# Altium schematic sheet 17 USB Type C.SchDoc
size 420 x 297 mm
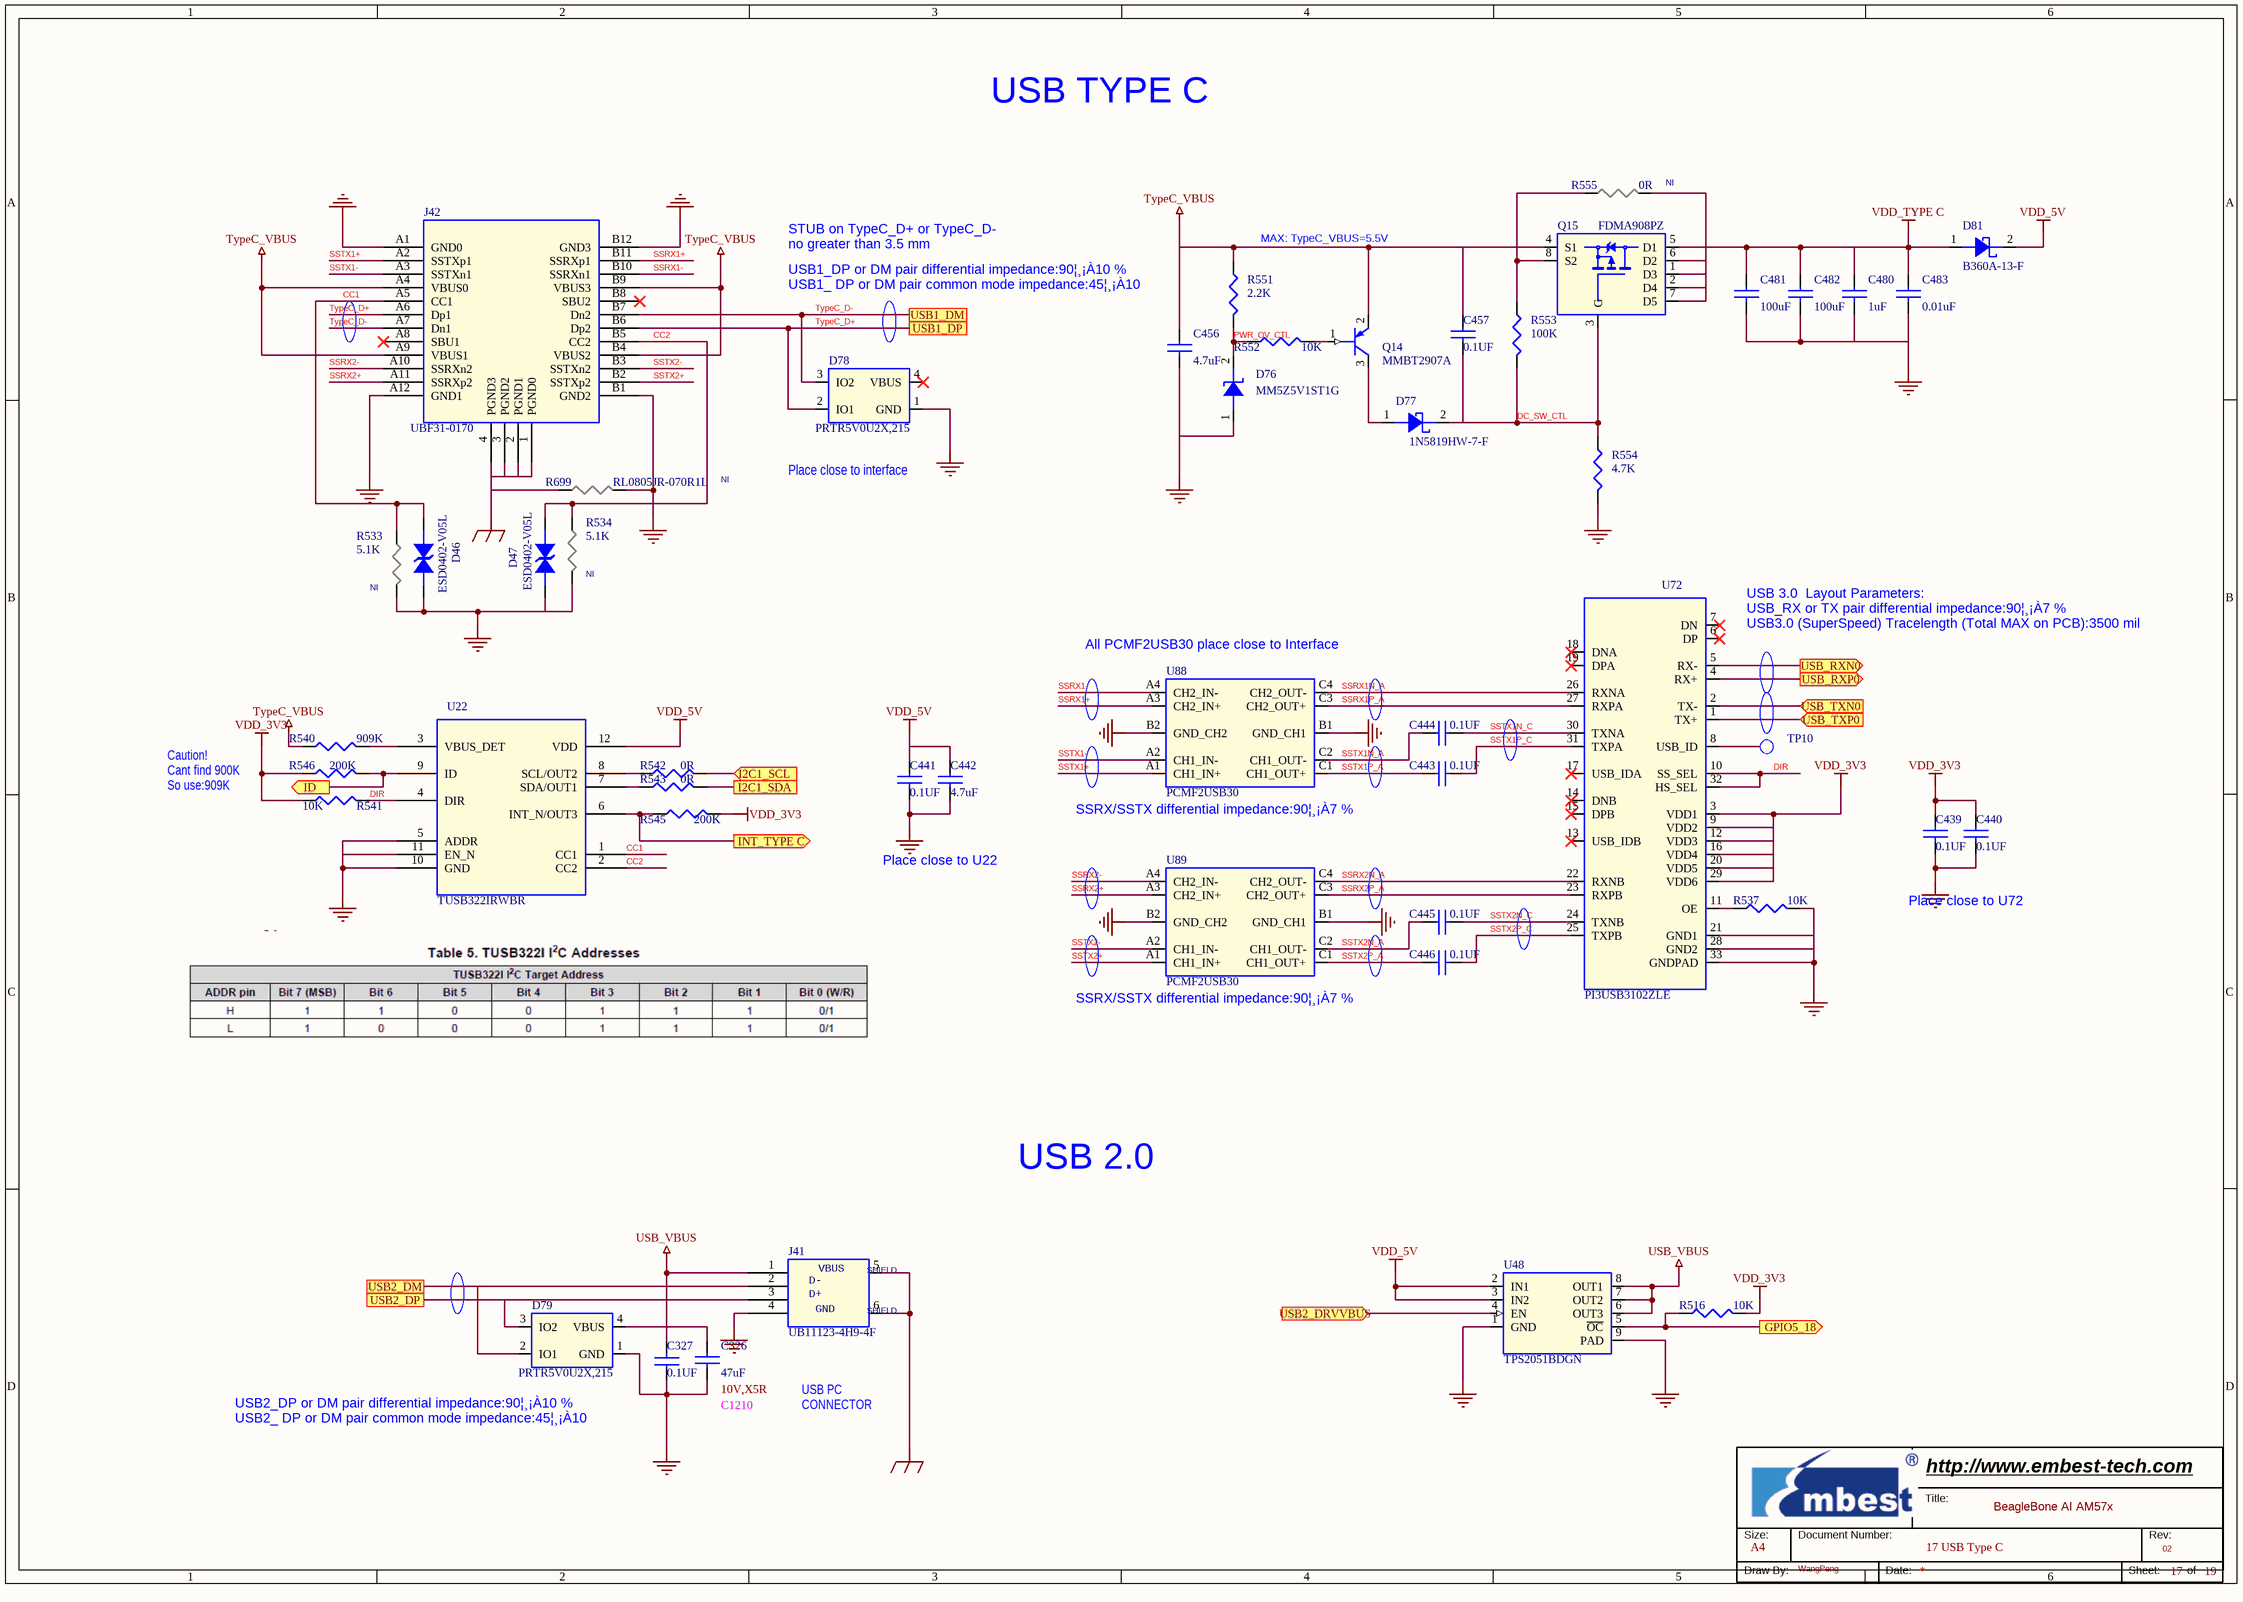
[diagram p0: 17 USB Type C.SchDoc]

## Parts
*  Page Count: 19  Page Number: 17  Page Size: A4  Title: BeagleBone AI AM57x  RevCode: 02  Doc: 17 USB Type C  Drawing: WangPeng  (hidden comment: Embest Title)  (graphical)
C326  47uF  Rating: 10V,X5R  [C1210]
C327  0.1UF  [C0402]
C439  0.1UF  [C0402]
C440  0.1UF  [C0402]
C441  0.1UF  [C0402]
C442  4.7uF  [C0603]
C443  0.1UF  [C0402]
C444  0.1UF  [C0402]
C445  0.1UF  [C0402]
C446  0.1UF  [C0402]
C456  4.7uF  [C0603]
C457  0.1UF  [C0402]
C480  1uF  [C0402]
C481  100uF  [C1210]
C482  100uF  [C1210]
C483  0.01uF  [C0402]
D46  ESD0402-V05L  [D0402]
D47  ESD0402-V05L  [D0402]
D76  MM5Z5V1ST1G  [sod523]
D77  1N5819HW-7-F  [sod123_a]
D78  PRTR5V0U2X,215  [SOT143_190P240X115-4N]
D79  PRTR5V0U2X,215  [SOT143_190P240X115-4N]
D81  B360A-13-F  [D_SMA]
J41  UB11123-4H9-4F  [usb_a_sh]
J42  UBF31-0170  [USB_MTCONN_UBF31-0170]
Q14  MMBT2907A  [SOT23_123]
Q15  FDMA908PZ  [DFN6_2FN]
R516  10K  [R0402]
R533  5.1K  ASSY: NI  [R0402]
R534  5.1K  ASSY: NI  [R0402]
R537  10K  [R0402]
R540  909K  [R0402]
R541  10K  [R0402]
R542  0R  [R0402]
R543  0R  [R0402]
R545  200K  [R0402]
R546  200K  [R0402]
R551  2.2K  [R0402]
R552  10K  [R0402]
R553  100K  [R0402]
R554  4.7K  [R0402]
R555  0R  ASSY: NI  [R0805]
R699  RL0805JR-070R1L  ASSY: NI  [R0805]
TP10  NI  [TP1-8040]  (value not drawn)
U22  TUSB322IRWBR  [X2QFN40P160X160X40-12N]
U48  TPS2051BDGN  [SOP8_1FH]
U72  PI3USB3102ZLE  [QFN40P300x600x80-33N]
U88  PCMF2USB30  [WLCSP10C40p3x4_117x157x60N]
U89  PCMF2USB30  [WLCSP10C40p3x4_117x157x60N]

## Ports
GPIO5_18 (out), I2C1_SCL (in), I2C1_SDA, ID (out), INT_TYPE C (out), USB1_DM, USB1_DP, USB2_DM, USB2_DP, USB2_DRVVBUS (in), USB_RXN0 (out), USB_RXP0 (out), USB_TXN0 (in), USB_TXP0 (in)

## Nets
GND: C326.2 C327.1 C439.2 C440.2 C441.2 C442.2 C456.2 C480.2 C481.2 C482.2 C483.2 D46.1 D47.1 D76.1(A) D78.1(GND) D79.1(GND) J41.4(P4) J42.A1(GND0) J42.A12(GND1) J42.B1(GND2) J42.B12(GND3) R533.2 R534.2 R537.2 R554.2 R699.2 U22.5(ADDR) U22.10(GND) U22.11(EN_N) U48.1(GND) U48.9(PAD) U72.21(GND1) U72.28(GND2) U72.33(GNDPAD) U88.B1(GND_CH1) U88.B2(GND_CH2) U89.B1(GND_CH1) U89.B2(GND_CH2)
GND_EARTH: J41.5(SHELD1) J41.6(PAD4) J42.1(PGND0) J42.2(PGND1) J42.3(PGND2) J42.4(PGND3) R699.1
TypeC_VBUS: C456.1 C457.1 J42.A4(VBUS0) J42.A9(VBUS1) J42.B4(VBUS2) J42.B9(VBUS3) Q14.2(E) Q15.4(S1) R540.1 R551.1
USB_VBUS: C327.2 J41.1(P1) U48.6(OUT3) U48.7(OUT2) U48.8(OUT1)
VDD_3V3: C439.1 C440.1 R516.2 R541.2 R545.2 R546.1 U72.3(VDD1) U72.9(VDD2) U72.12(VDD3) U72.16(VDD4) U72.20(VDD5) U72.29(VDD6)
VDD_5V: C441.1 C442.1 D81.2(C) U22.12(VDD) U48.2(IN1) U48.3(IN2)
VDD_TYPE C: C480.1 C481.1 C482.1 C483.1 D81.1(A) Q15.5(D1)
CC1: D46.2 J42.A5(CC1) R533.1 U22.1(CC1)
CC2: D47.2 J42.B5(CC2) R534.1 U22.2(CC2)
DC_SW_CTL: C457.2 D77.2(C) Q15.3(G) R553.2 R554.1
DIR: R541.1 U22.4(DIR) U72.10(SS_SEL) U72.32(HS_SEL)
GPIO5_18: R516.1 U48.5(~{OC}) ; port GPIO5_18
I2C1_SCL: R542.2 ; port I2C1_SCL
I2C1_SDA: R543.2 ; port I2C1_SDA
ID: R546.2 U22.9(ID) ; port ID
INT_TYPE C: R545.1 U22.6(INT_N/OUT3) ; port INT_TYPE C
PWR_OV_CTL: D76.2(C) R551.2 R552.1
SSRX1+: J42.B11(SSRXp1) U88.A3(CH2_IN+)
SSRX1-: J42.B10(SSRXn1) U88.A4(CH2_IN-)
SSRX1N_A: U72.26(RXNA) U88.C4(CH2_OUT-)
SSRX1P_A: U72.27(RXPA) U88.C3(CH2_OUT+)
SSRX2+: J42.A11(SSRXp2) U89.A3(CH2_IN+)
SSRX2-: J42.A10(SSRXn2) U89.A4(CH2_IN-)
SSRX2N_A: U72.22(RXNB) U89.C4(CH2_OUT-)
SSRX2P_A: U72.23(RXPB) U89.C3(CH2_OUT+)
SSTX1+: J42.A2(SSTXp1) U88.A1(CH1_IN+)
SSTX1-: J42.A3(SSTXn1) U88.A2(CH1_IN-)
SSTX1N_A: C444.1 U88.C2(CH1_OUT-)
SSTX1N_C: C444.2 U72.30(TXNA)
SSTX1P_A: C443.1 U88.C1(CH1_OUT+)
SSTX1P_C: C443.2 U72.31(TXPA)
SSTX2+: J42.B2(SSTXp2) U89.A1(CH1_IN+)
SSTX2-: J42.B3(SSTXn2) U89.A2(CH1_IN-)
SSTX2N_A: C445.1 U89.C2(CH1_OUT-)
SSTX2N_C: C445.2 U72.24(TXNB)
SSTX2P_A: C446.1 U89.C1(CH1_OUT+)
SSTX2P_C: C446.2 U72.25(TXPB)
TypeC_D+: D78.2(IO1) J42.A6(Dp1) J42.B6(Dp2) ; port USB1_DP
TypeC_D-: D78.3(IO2) J42.A7(Dn1) J42.B7(Dn2) ; port USB1_DM
USB2_DM: D79.2(IO1) J41.2(P2) ; port USB2_DM
USB2_DP: D79.3(IO2) J41.3(P3) ; port USB2_DP
USB2_DRVVBUS: U48.4(EN) ; port USB2_DRVVBUS
USB_RXN0: U72.5(RX-) ; port USB_RXN0
USB_RXP0: U72.4(RX+) ; port USB_RXP0
USB_TXN0: U72.2(TX-) ; port USB_TXN0
USB_TXP0: U72.1(TX+) ; port USB_TXP0
NetC326_1: C326.1 D79.4(VBUS)
NetD77_1: D77.1(A) Q14.3(C)
NetQ14_1: Q14.1(B) R552.2
NetQ15_1: Q15.1(D3) Q15.2(D4) Q15.6(D2) Q15.7(D5) R555.2
NetQ15_8: Q15.8(S2) R553.1 R555.1
NetR537_1: R537.1 U72.11(OE)
NetR540_2: R540.2 U22.3(VBUS_DET)
NetR542_1: R542.1 U22.8(SCL/OUT2)
NetR543_1: R543.1 U22.7(SDA/OUT1)
NetTP10_1: TP10.1(TP) U72.8(USB_ID)

Not connected (* = marked no-connect by the designer): D78 4(VBUS)*; J42 A8(SBU1)* B8(SBU2)*; U72 6(DP)* 7(DN)* 13(USB_IDB)* 14(DNB)* 15(DPB)* 17(USB_IDA)* 18(DNA)* 19(DPA)*

## Notes on the sheet
- USB TYPE C
- STUB on TypeC_D+ or TypeC_D-
  no greater than 3.5 mm
- USB1_DP or DM pair differential impedance:90¦¸¡À10 %
  USB1_ DP or DM pair common mode impedance:45¦¸¡À10
- (near R551) MAX: TypeC_VBUS=5.5V
- Place close to interface
- (near U72) USB 3.0  Layout Parameters:
  USB_RX or TX pair differential impedance:90¦¸¡À7 %
  USB3.0 (SuperSpeed) Tracelength (Total MAX on PCB):3500 mil
- (near U88) All PCMF2USB30 place close to Interface
- Caution!
  Cant find 900K
  So use:909K
- (near U88) SSRX/SSTX differential impedance:90¦¸¡À7 %
- Place close to U22
- Place close to U72
- (near U89) SSRX/SSTX differential impedance:90¦¸¡À7 %
- USB 2.0
- (near D79) USB2_DP or DM pair differential impedance:90¦¸¡À10 %
  USB2_ DP or DM pair common mode impedance:45¦¸¡À10
- USB PC
  CONNECTOR
- (in symbol Embest Title) Title:; Size:; Document Number:; Rev:; Draw By:; Date:; Sheet:; of
- (in symbol USB4A_2) VBUS; SHIELD; D-; D+; GND

## Library data of the parts
C326 = C: CAP,47UF,+/-20%,X5R,10V,SMD1210; Manufacturer: MURATA; Manufacturer Part Number: GRM32ER61A476ME20; Embest PN: 1004001100185; PCB Footprint: C1210; Part Type: Ceramic Capacitor
C327 C439-C441 C457 = C: CAP,100NF,+/-10%,X7R,16V,SMD0402; Manufacturer Part Number: GRM155R71C104KA88D; Manufacturer: Murata; Embest PN: 1004001100047; Datasheet: Y:\ÐÂK3ÏµÍ³ÎïÁÏdatasheet\[1003_1004]capacitor-resistor µçÈÝ¡¢µç×è\1004001100047-GRM155R71C104KA88D.pdf; Part Type: Ceramic Capacitor
  C439-C441: Size: 1005
C442 = C: CAP,4.7UF,+/-10%,X5R,16V,SMD0603; Manufacturer: Murata; Manufacturer Part Number: GRM188R61C475KAAJD; Embest PN: 1004001100127; Size: 1608; Part Type: Ceramic Capacitor; Datasheet: Y:\ÐÂK3ÏµÍ³ÎïÁÏdatasheet\[1003_1004]capacitor-resistor µçÈÝ¡¢µç×è\1004001100127 GRM188R61C475KAAJD murata.pdf
C443-C446 = C: CAP,100NF,+/-10%,X7R,16V,SMD0402; Manufacturer: Murata; Manufacturer Part Number: GRM155R71C104KA88D; Embest PN: 1004001100047; Size: 1005; Part Type: Ceramic Capacitor; Datasheet: Y:\ÐÂK3ÏµÍ³ÎïÁÏdatasheet\[1003_1004]capacitor-resistor µçÈÝ¡¢µç×è\1004001100047-GRM155R71C104KA88D.pdf
C456 = C: CAP,4.7UF,+/-10%,X5R,16V,SMD0603; Manufacturer Part Number: GRM188R61C475KAAJD; Manufacturer: Murata; Embest PN: 1004001100127; Datasheet: Y:\ÐÂK3ÏµÍ³ÎïÁÏdatasheet\[1003_1004]capacitor-resistor µçÈÝ¡¢µç×è\1004001100127 GRM188R61C475KAAJD murata.pdf; Part Type: Ceramic Capacitor
C480 = C: CAP,1UF,+/-10%,X5R,10V,SMD0402; Manufacturer Part Number: GRM155R61A105KE15D; Manufacturer: Murata; Embest PN: 1004001100057; Part Type: Ceramic Capacitor
C481 C482 = C: CAP,100UF,+/-20%,X5R,6.3V,SMD1210; Manufacturer Part Number: GRM32ER60J107ME20#; Manufacturer: MURATA; Embest PN: 1004001100198; Part Type: Ceramic Capacitor
C483 = C: CAP,10NF,+/-10%,X7R,16V,SMD0402; Manufacturer Part Number: GRM155R71C103KA01D; Manufacturer: MURATA; Embest PN: 1004001100039; Part Type: Ceramic Capacitor
D46 D47 = Diode TVS Dual: Diode,TVS,ESD0402-V05L, 5V, 0.1pF,0402,SMD; Manufacturer: TOPS; Embest PN: 1006005100089; Part Type: ESD; Manufacturer Part Number: ESD0402-V05L; Datasheet: Y:\ÐÂK3ÏµÍ³ÎïÁÏdatasheet\[1006002~013]diodes-transistors ¶þÈý¼«¹Ü\1006005100089 ESD0402-V5L.pdf
D76 = Diode Zener: Diode,Zener Diode,MM5Z5V1ST1G,5.1V,+/-2%,200 mW,SOD523,SMD,-65~155,AEC-Q101,TR; Manufacturer: ON; Embest PN: 1006004100023; Datasheet: Y:\ÐÂK3ÏµÍ³ÎïÁÏdatasheet\[1006002~013]diodes-transistors ¶þÈý¼«¹Ü\1006004100023_MM5Z5V1ST1G_ON.PDF; Manufacturer Part Number: MM5Z5V1ST1G; Part Type: Diode
D77 = Diode Schottky: Diode,Schottky Diode,1N5819HW-7-F,40V,1A,SOD-123,SMD,-65~125,TR; Manufacturer: DIODES; Embest PN: 1006002100003; Datasheet: Y:\ÐÂK3ÏµÍ³ÎïÁÏdatasheet\[1006002~013]diodes-transistors ¶þÈý¼«¹Ü\1006002100003_1N5819HW_DIODES.pdf; Manufacturer Part Number: 1N5819HW-7-F; Part Type: Diode
D78 D79 = WE05R: Diode,TVS,PRTR5V0U2X, 5.5V,SOT-143B,SMD; Manufacturer: NXP; Embest PN: 1006005100016; Part Type: ESD; Manufacturer Part Number: PRTR5V0U2X,215; Status: Hamster AM572x
D81 = Diode Schottky: Diode,Schottky Diode,B360A-13-F,60V,3A,SMA,SMD; Manufacturer: DIODES; Embest PN: 1006002100006; Part Type: Diode; Manufacturer Part Number: B360A-13-F; Datasheet: Y:\ÐÂK3ÏµÍ³ÎïÁÏdatasheet\[1006002~013]diodes-transistors ¶þÈý¼«¹Ü\1006002100006 B360A-13-F diodes.pdf
J41 = USB4A_2: Connector,USB A port,4 Position,female,Right Angle,30u GXT Contact,black,DIP; Manufacturer: Foxcon; Embest PN: 1009007200069; Part Type: USB Connector; Manufacturer Part Number: UB11123-4H9-4F; Status: TBD; Datasheet: Y:\ÐÂK3ÏµÍ³ÎïÁÏdatasheet\[1009]connectors Á¬½ÓÆ÷\1009007200069 [UB11123-4H9-4F].pdf
J42 = USCF-001C2BC01-11: Connector,USB type C port,female,flat insert,SMT/THT;; Manufacturer: MTCONN; Embest PN: 1009007100107; Datasheet: Y:\ÐÂK3ÏµÍ³ÎïÁÏdatasheet\[1009]connectors Á¬½ÓÆ÷\1009007100107 UBF31-0170; Status: BeagleBone AI; Manufacturer Part Number: UBF31-0170; Part Type: USB Connector
Q14 = PNP: Transistor,PNP,MMBT2907A-7-F,60V,600MA,SOT-23,SMD; Manufacturer: Diodes; Embest PN: 1006012100001; Part Type: Transistor; Manufacturer Part Number: MMBT2907A-7-F; Datasheet: Y:\ÐÂK3ÏµÍ³ÎïÁÏdatasheet\[1006002~013]diodes-transistors ¶þÈý¼«¹Ü\1006012100001 Diodes MMBT2907A-7-F.pdf
Q15 = PMOS_2S1G5D: MOSFET,Single P-Channel PowerTrench MOSFET,-12A, -12V,12.5 mohm,microFET2x2(8Pin),SMD; Manufacturer: FAIRCHILD; Embest PN: 1006014100031; Part Type: MOSFET; Manufacturer Part Number: FDMA908PZ; Datasheet: Y:\ÐÂK3ÏµÍ³ÎïÁÏdatasheet\[1006014~16]mosfet ³¡Ð§Ó¦¹Ü\1006014100031_FDMA908PZ_fairchild.pdf
R516 R537 = R: RES,10K,+/-1%,1/16W,SMD0402; Manufacturer Part Number: RC0402FR-0710KL; Manufacturer: YAGEO; Embest PN: 1003001100071; Part Type: Thick film Resistor
R533 = R: RES,5K1,+/-1%,1/16W,SMD0402; Manufacturer: YAGEO; Manufacturer Part Number: RC0402FR-075K1L; Embest PN: 1003001100059; Part Type: Thick film Resistor
R534 = R: RES,5K1,+/-1%,1/16W,SMD0402; Manufacturer Part Number: RC0402FR-075K1L; Manufacturer: YAGEO; Embest PN: 1003001100059; Part Type: Thick film Resistor
R540 = R: RES,909K,+/-1%,1/16W,SMD0402; Manufacturer: YAGEO; Manufacturer Part Number: RC0402FR-07909KL; Embest PN: 1003001101493; Part Type: Thick film Resistor; Status: BeagleBone AI
R541 = R: RES,10K,+/-5%,1/16W,SMD0402; Manufacturer Part Number: RC0402JR-0710KL; Manufacturer: YAGEO; Embest PN: 1003001100072; Part Type: Thick film Resistor
R542 R543 = R: RES,0R,+/-5%,1/16W,SMD0402; Manufacturer: YAGEO; Manufacturer Part Number: RC0402JR-070RL; Embest PN: 1003001100001; Part Type: Thick film Resistor
R545 R546 = R: RES,200K,+/-5%,1/16W,SMD0402; Manufacturer Part Number: RC0402JR-07200KL; Manufacturer: YAGEO; Embest PN: 1003001100130; Part Type: Thick film Resistor
R551 = R: RES,2K2,+/-5%,1/16W,SMD0402; Manufacturer: YAGEO; Manufacturer Part Number: RC0402JR-072K2L; Embest PN: 1003001100046; Part Type: Thick film Resistor
R552 = R: RES,10K,+/-5%,1/16W,SMD0402; Manufacturer: YAGEO; Manufacturer Part Number: RC0402JR-0710KL; Embest PN: 1003001100072; Part Type: Thick film Resistor
R553 = R: RES,100K,+/-5%,1/16W,SMD0402; Manufacturer Part Number: RC0402JR-07100KL; Manufacturer: YAGEO; Embest PN: 1003001100119; Part Type: Thick film Resistor
R554 = R: RES,4K7,+/-5%,1/16W,SMD0402; Manufacturer Part Number: RC0402JR-074K7L; Manufacturer: YAGEO; Embest PN: 1003001100057; Part Type: Thick film Resistor
R555 = R: RES,0R,+/-5%,1/2W,SMD0805; Manufacturer: YAGEO; Manufacturer Part Number: RC0805JR-070RL; Embest PN: 1003001100295; Part Type: Thick film Resistor
R699 = R: RES,0R1,+/-5%,1/8W,SMD0805; Manufacturer: Yageo; Rating: <Rating>; Embest PN: 1003001100451; Status: TBD; Manufacturer Part Number: RL0805JR-070R1L; Part Type: Thick film Resistor
TP10 = TEST POINT: Test point,DIA 30mil; Embest PN: PN008; PCB Footprint: TP30; Part Type: TP
U22 = TUSB322IRWBR: USB Type C Configuration Channel Logic and Port Control with VCONN; Manufacturer: TI; Embest PN: 1002010100214; PCB Footprint: X2QFN40P160X160X40-12N; Datasheet: Y:\ÐÂK3ÏµÍ³ÎïÁÏdatasheet\[1002]IC ¼¯³ÉµçÂ·\1002010100214 tusb322i.pdf; Status: Hamster AM572x; Manufacturer Part Number: TUSB322IRWBR; Part Type: IC
U48 = TPS2051BDGN: IC,Current-Limited Power-distribution Switches,TPS2051BDGN,8-MSOP-PowerPad,SMD; Manufacturer: TI; Embest PN: 1002004100054; Datasheet: Y:\ÐÂK3ÏµÍ³ÎïÁÏdatasheet\[1002]IC ¼¯³ÉµçÂ·\1002004100054_tps2051b_TI.pdf; Status: AVL; Manufacturer Part Number: TPS2051BDGN; Part Type: Power Switch
U72 = PI3USB3102ZLE: IC USB3.0&USB2.0 SWITCH 32TQFN; Manufacturer: Pericom; Embest PN: 1002010100194; Datasheet: Y:\ÐÂK3ÏµÍ³ÎïÁÏdatasheet\[1002]IC ¼¯³ÉµçÂ·\1002010100194 PI3USB3102.pdf; Status: BBB_AM572X; Manufacturer Part Number: PI3USB3102ZLE; Part Type: Interface
U88 U89 = PCMF2USB30: Common-mode EMI filter for differential channels with integrated ESD protection /; Manufacturer: Nexperia; Embest PN: 1013002100028; PCB Footprint: WLCSP10C40p3x4_117x157x60N; Part Type: Common Mode Inductor; Manufacturer Part Number: PCMF2USB30; Status: Hamster AM572x; Datasheet: Y:\ÐÂK3ÏµÍ³ÎïÁÏdatasheet\[1013_1014]transformer-filter ±äÑ¹Æ÷¡¢ÂË²¨\1013002100028 PCMFXUSB30_SER.pdf
* = Embest Title: Page Create Date: May 29, 2006; WebSite: http://www.embest-tech.com; Company: Embest; Page Modify Date: *